# EAGLE design 3w developer v3 (EAGLE 5.07)
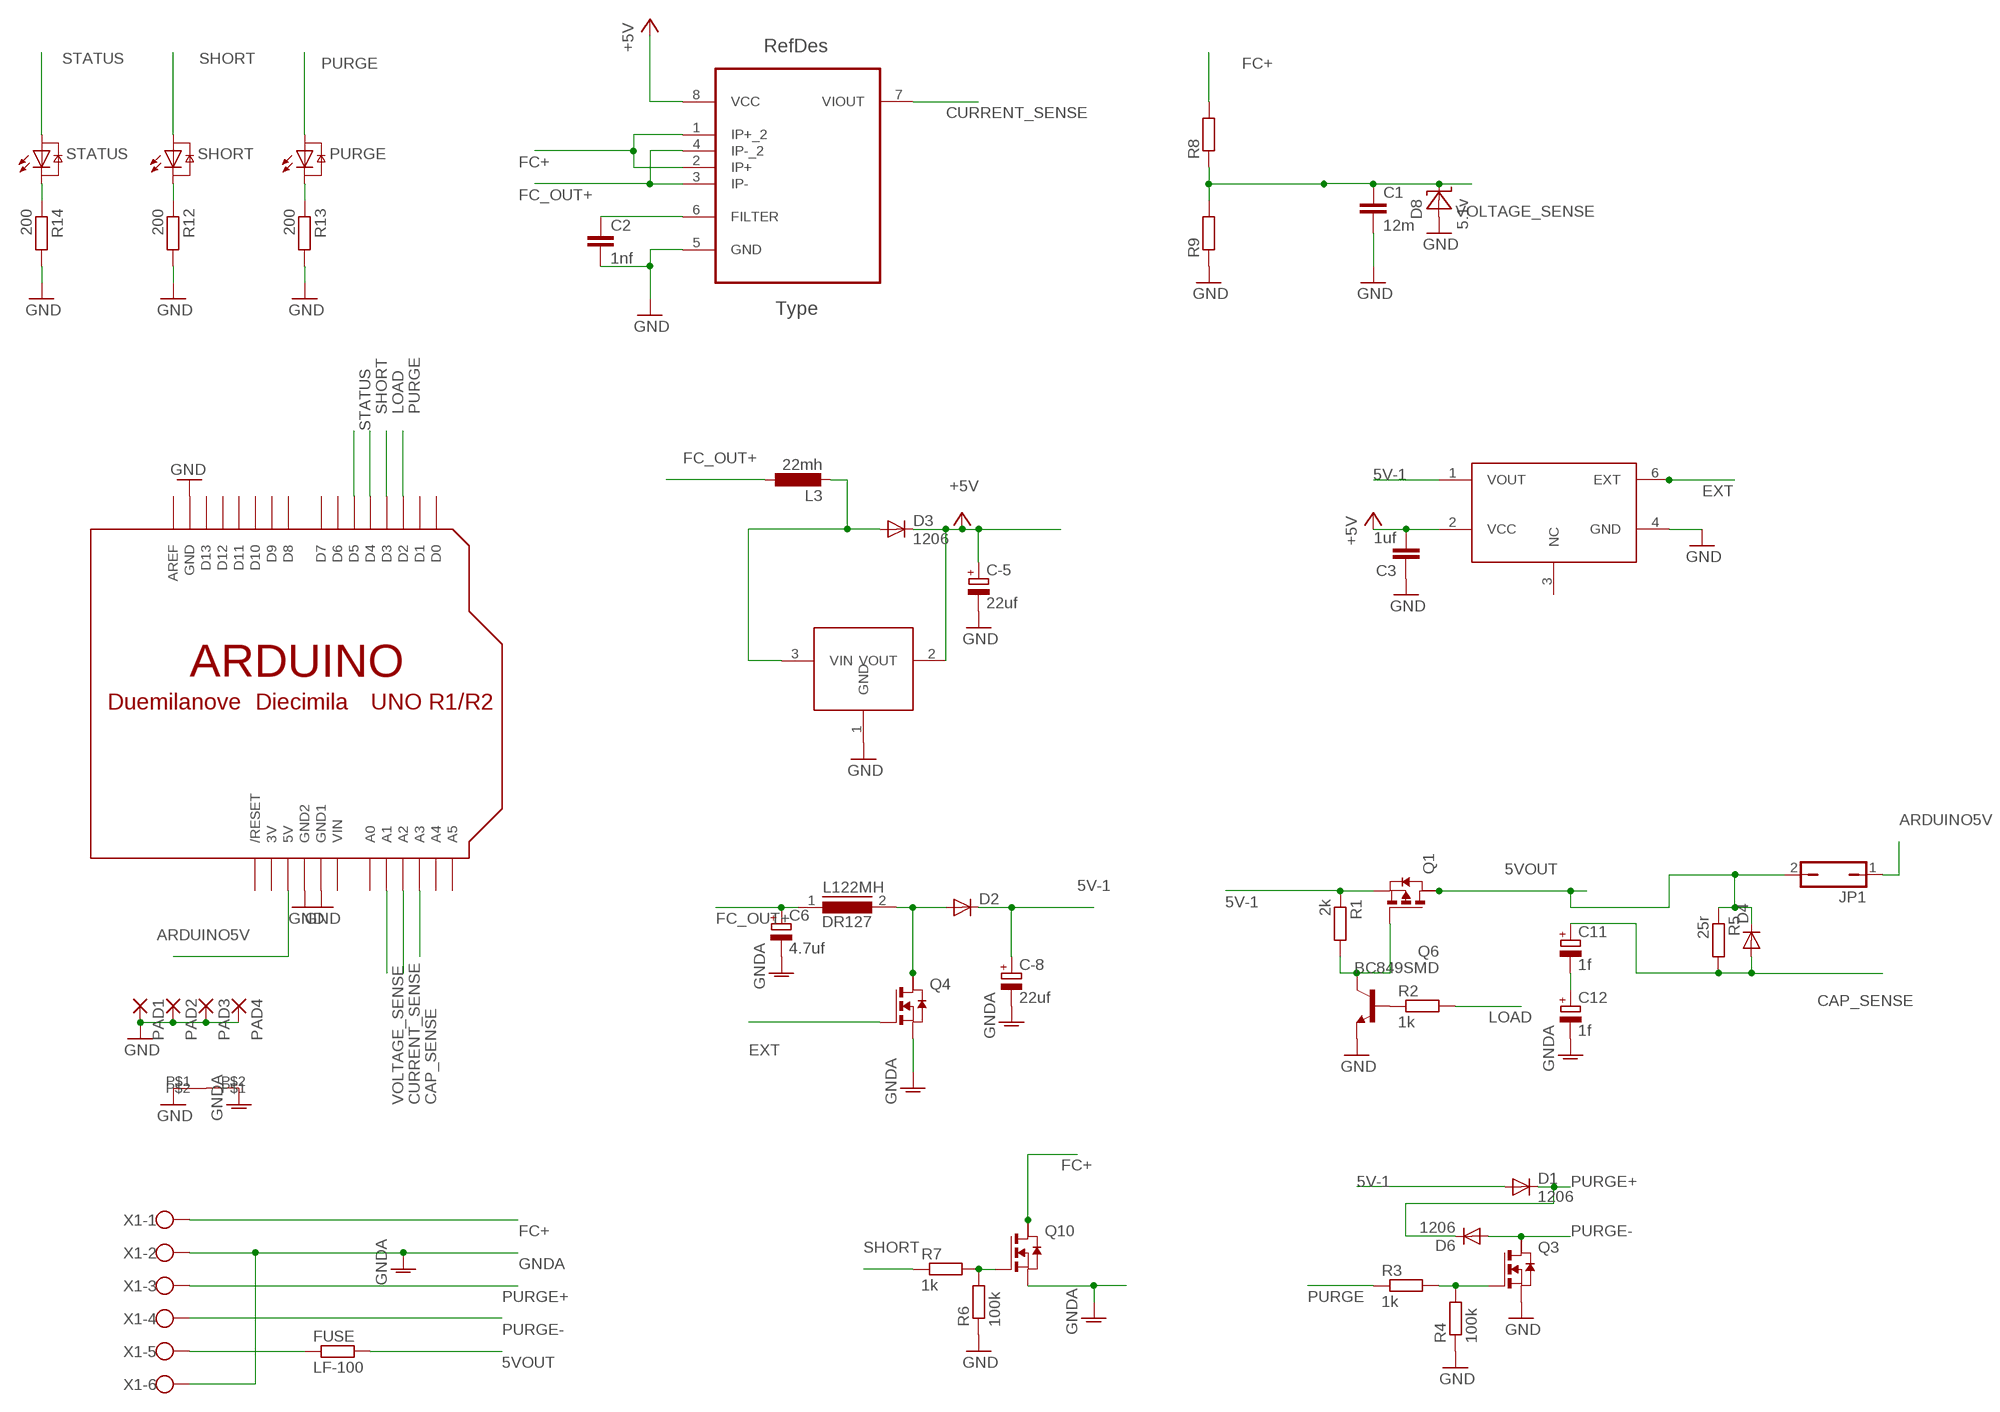
[diagram p0: schematic, sheet 1]

## Parts
C1  12m  C-EUC1206  [C1206]
C2  1nf  C-EUC1206  [C1206]
C3  1uf  C-EUC1206  [C1206]
C6  4.7uf  CPOL-EUSMCC  [SMC_C]
C11  1f  CPOL-EUE5-10.5  [E5-10,5]
C12  1f  CPOL-EUE5-10.5  [E5-10,5]
C-5  22uf  CPOL-EUSMCD  [SMC_D]
C-8  22uf  CPOL-EUSMCD  [SMC_D]
D1  1206  DIODE-GF1  [GF1]
D2  DIODE-DO214AA  [DO214AA]
D3  1206  DIODE-DO214AA  [DO214AA]
D4  DIODE-DO214AA  [DO214AA]
D6  1206  DIODE-GF1  [GF1]
D8  5.1v  1206ZENER  [C1206]
FUSE  LF-100  [LF100]
JP1  JP1Q  [JP1]
L3  22mh  L-EU  [MURATA-45223]
L122MH  DR127  [DR127]
PAD1  1,6/0,8  [1,6/0,8]
PAD2  1,6/0,8  [1,6/0,8]
PAD3  1,6/0,8  [1,6/0,8]
PAD4  1,6/0,8  [1,6/0,8]
PURGE  GM5BW96385A  [GM5BW96385A]
Q1  PMOSSOT223  [SOT223]
Q3  NMOSSOT223  [SOT223]
Q4  NMOSSOT223  [SOT223]
Q6  BC849SMD  [SOT23-BEC]
Q10  NMOSSOT223  [SOT223]
R1  2k  R-EU_M1206  [M1206]
R2  1k  R-EU_M1206  [M1206]
R3  1k  R-EU_M1206  [M1206]
R4  100k  R-EU_M1206  [M1206]
R5  25r  R-EU_R2512  [R2512]
R6  100k  R-EU_M1206  [M1206]
R7  1k  R-EU_M1206  [M1206]
R8  R-EU_R1206  [R1206]
R9  R-EU_R1206  [R1206]
R12  200  R-EU_M1206  [M1206]
R13  200  R-EU_M1206  [M1206]
R14  200  R-EU_M1206  [M1206]
SHORT  GM5BW96385A  [GM5BW96385A]
STATUS  GM5BW96385A  [GM5BW96385A]
U$3  ARDUINO-NOHOLE  [ARDUINO-NOHOLE]
U$4  SHORT  [SHORT]
UC1  MINIPAK-7750  [SOT89]
UC2  MINIPAK-E50  [SOT23-6]
UC3  ACS712ELCTR-05B-T  [SOIC127P600X175-8N]
X1  W237-6  [W237-6]

## Nets
5V-1: C-8.+ D1.A D2.C Q1.3(S) R1.1 UC2.1(VOUT)
5VOUT [power]: D4.C FUSE.P$2 JP1.2 Q1.2(D) R5.1
+5V [medpower]: C3.2 C-5.+ D3.C UC1.2(VOUT) UC2.2(VCC) UC3.8(VCC)
ARDUINO5V [medpower]: JP1.1 U$3.5V
CAP_SENSE: C11.+ D4.A R5.2 U$3.A3
CURRENT_SENSE: U$3.A2 UC3.7(VIOUT)
EXT: Q4.1(G) UC2.6(EXT)
FC+ [power]: Q10.2(D) R8.2 UC3.1(IP+_2) UC3.2(IP+) X1.1
FC_OUT+ [power]: C6.+ L3.P$1 L122MH.1 UC3.3(IP-) UC3.4(IP-_2)
GND: C1.2 C2.2 C3.1 C-5.- D8.ANODE(A) PAD1.1(P) PAD2.1(P) PAD3.1(P) PAD4.1(P) Q3.3(S) Q6.E R4.1 R6.1 R9.1 R12.2 R13.2 R14.2 U$3.GND U$3.GND1 U$3.GND2 U$4.P$1 UC1.1(GND) UC2.4(GND) UC3.5(GND)
GNDA [power]: C6.- C12.- C-8.- Q4.3(S) Q10.3(S) U$4.P$2 X1.2 X1.6
LOAD: R2.2 U$3.D3
N$1: Q10.1(G) R6.2 R7.2
N$2: Q1.1(G) Q6.C R1.2
N$3: D2.A L122MH.2 Q4.2(D)
N$5: Q6.B R2.1
N$6: D3.A L3.P$2 UC1.3(VIN)
N$7: Q3.1(G) R3.2 R4.2
N$8 [power]: C11.- C12.+
N$9: C2.1 UC3.6(FILTER)
N$10 [power]: FUSE.P$5 X1.5
N$14: R12.1 SHORT.C
N$15: PURGE.C R13.1
N$16: R14.1 STATUS.C
PURGE: PURGE.A R3.1 U$3.D2
PURGE+ [medpower]: D1.C D6.C X1.3
PURGE- [medpower]: D6.A Q3.2(D) X1.4
SHORT: R7.1 SHORT.A U$3.D4
STATUS: STATUS.A U$3.D5
VOLTAGE_SENSE: C1.1 D8.CATHODE(C) R8.1 R9.2 U$3.A1
Unconnected: Q1.4(D2) Q3.4(D2) Q4.4(D2) Q10.4(D2) U$3.A0 U$3.A4 U$3.A5 U$3.AREF U$3.D0 U$3.D1 U$3.D6 U$3.D7 U$3.D8 U$3.D9 U$3.D10 U$3.D11 U$3.D12 U$3.D13 U$3.RESET(/RESET) UC2.3(NC)

## Power pins joined to a net without a drawn wire
3V: U$3.3V
VIN: U$3.VIN

## Library data of the parts
C1-C3 = matt rcl:C-EU: CAPACITOR, European symbol
C6 = rcl:CPOL-EU: POLARIZED CAPACITOR, European symbol
C11 C12 C-5 C-8 = matt rcl:CPOL-EU: POLARIZED CAPACITOR, European symbol
D1-D4 D6 = matt diode:DIODE-: DIODE
D8 = matt diode:1206ZENER
FUSE = matt rcl:LF-100: polyfuse lf100 littelfuse
JP1 = jumper:JP1Q: JUMPER
L3 = matt rcl:L-EU: INDUCTOR, European symbol
L122MH = inductors:DR127: High Power Density, High Efficiency, Shielded Inductors Source: coiltronics_dr_series.pdf
PAD1-PAD4 = wirepad:1,6/0,8: THROUGH-HOLE PAD
PURGE SHORT STATUS = matt led:GM5BW96385A: High brightness White Color LED 2300 mcd @ IF = 20mA achieved via InGaN Blue LED chip in combination with Yellow Phosphor Source: http://document.sharpsma.com/files/GM5BW96385A.pdf
Q1 = zetex:PMOSSOT223: MOS FET
Q3 Q4 Q10 = zetex:NMOSSOT223: MOS FET
Q6 = matt transistor-npn:BC849*: NPN Transistor
R1-R4 R6 R7 R12-R14 = resistor:R-EU_: RESISTOR, European symbol
R5 R8 R9 = matt rcl:R-EU_: RESISTOR, European symbol
U$3 = adafruit:ARDUINO: Arduino Diecimila/Duemilanove Make a shield with ease, this package has all the named pins as well as the two mounting drill holes and an outline of the USB and DC power connector. The outline is on the DIMENSION layer, so if your board house uses it they will cut the outline to match. http://www.ladyada.net/library/pcb/eaglelibrary.html
U$4 = matt:SHORT
UC1 = matt:MINIPAK-7750
UC2 = matt:MINIPAK-E50
UC3 = matt-allegro:ACS712ELCTR-05B-T: Linear Current Sensor; DESCRIPTION: Linear Current Sensor; MPN: ACS712ELCTR-05B-T; OC_FARNELL: 27M3644; OC_NEWARK: 1329623; PACKAGE: SOIC-8; SUPPLIER: Allegro
X1 = con-wago-500:W237-6: WAGO SCREW CLAMP

## Net classes
1 power: width 3 mm
2 medpower: width 1 mm

## Board
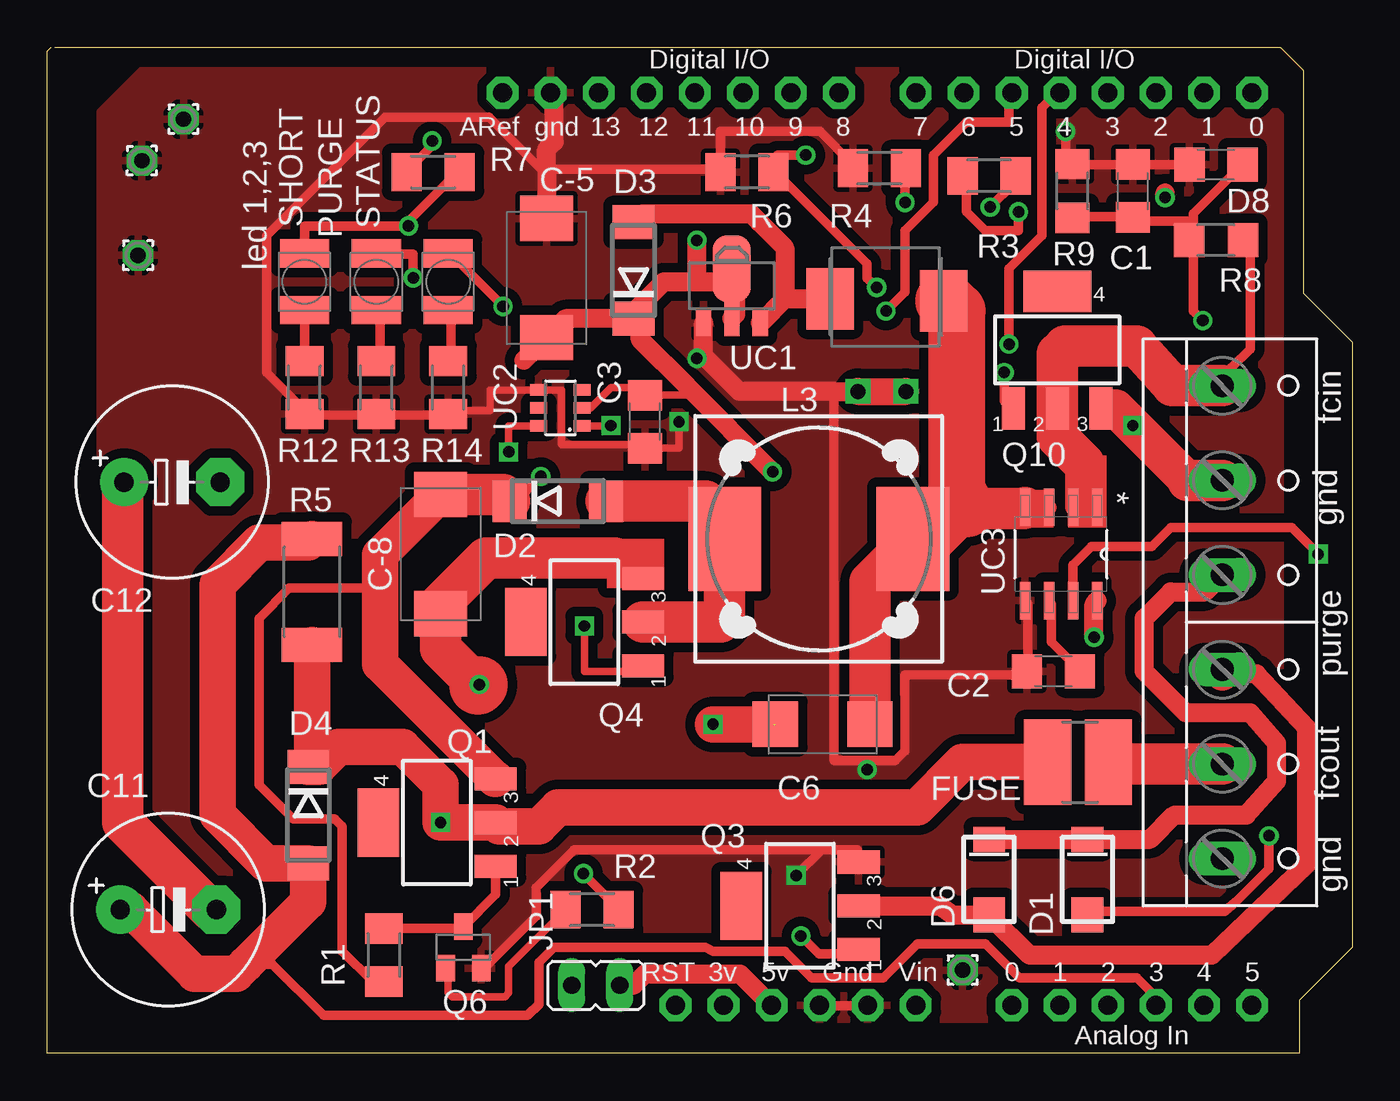
[diagram p1: board, top side]
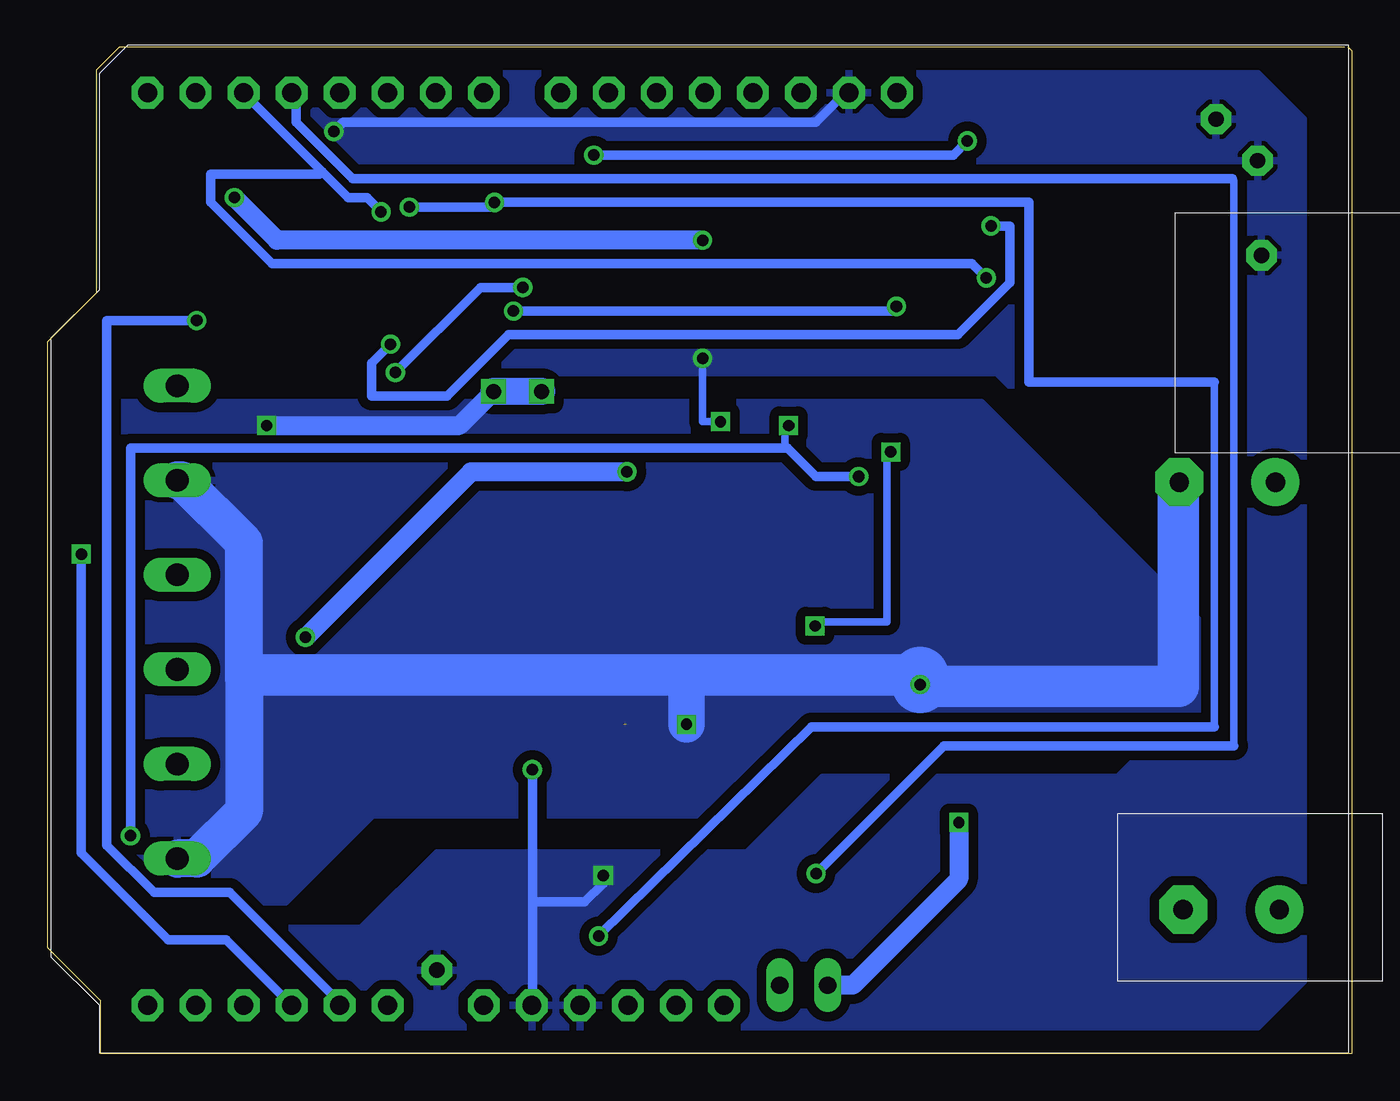
[diagram p2: board, bottom side, seen from below]

Size 69 x 53.2 mm. Coordinates in mm from the lower left corner, seen from the top.
Outline: 0.4,53.2 65.2,53.2 66.4,52 66.4,40.2 69,37.6 69,5.6 66.2,2.8 66.2,0 0,0 0,53 0.2,53.2
Copper layers (1*16): Top 0.035mm / dielectric 1.5mm / Bottom 0.035mm
Design rules "default *": minimum track width 20mil, minimum drill 24mil, track to track 10mil, track to pad 10mil, pad to pad 10mil, via to via 10mil, smd to smd 10mil, copper to edge 40mil, drill to drill 8mil, minimum pad ring 10mil, minimum via ring 8mil, stop-mask expansion 4mil, vias tented up to drill 0mil, thermal gap 10mil

### Footprints (pad centres in the part's own frame; a part is rotated, then mirrored left to right if it is on the bottom)
C1206 = smd 1.6 x 1.8: 1 -1.4,0; 2 1.4,0
SMC_C = smd 2.4 x 2.4: + -2.5,0; - 2.5,0
E5-10,5 = drill 1.016 pad 2.54 round: + -2.54,0 | drill 1.016 pad 2.54 octagon: - 2.54,0
SMC_D = smd 2.4 x 2.8: + -3.15,0; - 3.15,0
GF1 = smd 1.85 x 1.68: A 1.87,0 | smd 1.32 x 1.68: C -2.12,0
DO214AA = smd 1.8 x 2.2: A 2.55,0; C -2.55,0
C1206' = smd 1.6 x 1.8: ANODE -1.4,0; CATHODE 1.4,0
LF100 = smd 2.5 x 4.5: P$2 -1.7,0; P$5 1.5,0
JP1 = drill 0.914 long: 1 0,-1.27; 2 0,1.27
MURATA-45223 = smd 2.5 x 3.25: P$1 -3.6,0.2; P$2 2.4,0.1
DR127 = smd 3.85 x 5.5: 1 -4.975,0; 2 4.975,0
1,6/0,8 = drill 0.813 pad 1.6 octagon: 1 0,0
GM5BW96385A = smd 1.5 x 2.6: A -1.5,0; C 1.5,0
SOT223 = smd 1.219 x 2.235: 1 -2.311,-3.099; 2 0,-3.099; 3 2.311,-3.099 | smd 3.6 x 2.2: 4 0,3.099
SOT23-BEC = smd 1 x 1.4: B -0.95,-1.1; C 0,1.1; E 0.95,-1.1
M1206 = smd 1.6 x 2: 1 -1.4,0; 2 1.4,0
R2512 = smd 1.8 x 3.2: 1 -2.8,0; 2 2.8,0
R1206 = smd 1.6 x 1.803: 1 -1.422,0; 2 1.422,0
ARDUINO-NOHOLE = drill 1 pad 1.676 octagon: 3V 35.56,2.54; 5V 38.1,2.54; A0 50.8,2.54; A1 53.34,2.54; A2 55.88,2.54; A3 58.42,2.54; A4 60.96,2.54; A5 63.5,2.54; AREF 23.876,50.8; D0 63.5,50.8; D1 60.96,50.8; D2 58.42,50.8; D3 55.88,50.8; D4 53.34,50.8; D5 50.8,50.8; D6 48.26,50.8; D7 45.72,50.8; D8 41.656,50.8; D9 39.116,50.8; D10 36.576,50.8; D11 34.036,50.8; D12 31.496,50.8; D13 28.956,50.8; GND 26.416,50.8; GND1 43.18,2.54; GND2 40.64,2.54; RESET 33.02,2.54; VIN 45.72,2.54
SHORT = drill 0.8 square: P$1 -2.54,0; P$2 0,0
SOT89 = smd 0.8 x 1.4: 1 -1.499,-1.981; 3 1.499,-1.981 | smd 0.8 x 1.9: 2 0,-1.727 | smd 2 x 3.5: 2.1 0,0.889
SOT23-6 = smd 0.6 x 0.9: 1 -2.22,0.12; 2 -1.27,0.12; 3 -0.32,0.12; 4 -0.32,2.42; 5 -1.27,2.42; 6 -2.22,2.42
SOIC127P600X175-8N = smd 1.981 x 0.559: 1 -2.464,1.905; 2 -2.464,0.635; 3 -2.464,-0.635; 4 -2.464,-1.905; 5 2.464,-1.905; 6 2.464,-0.635; 7 2.464,0.635; 8 2.464,1.905
W237-6 = drill 1.194 long: 1 -12.5,-1.27; 2 -7.5,-1.27; 3 -2.5,-1.27; 4 2.5,-1.27; 5 7.5,-1.27; 6 12.5,-1.27

### Placement (x,y rotation side)
C1  57.4,45.6 90 top
C2  53.2,20.2 180 top
C3  31.6,33.4 90 top
C6  41,17.4 180 top
C11  6.4,7.6 0 top
C12  6.6,30.2 0 top
C-5  26.4,41 90 top
C-8  20.8,26.4 270 top
D1  55,9.2 270 top
D2  27,29.2 0 top
D3  31,41.4 90 top
D4  13.8,12.6 270 top
D6  49.8,9.2 270 top
D8  5.1v  [C1206']  61.8,47 0 top
FUSE  54.6,15.4 0 top
JP1  29,3.6 90 top
L3  43.8,40 180 top
L122MH  40.8,27.2 180 top
PAD1  7.2,49.4 0 top
PAD2  5,47.2 0 top
PAD3  4.8,42.2 0 top
PAD4  48.4,4.4 0 top
PURGE  17.4,40.8 270 top
Q1  20.6,12.2 90 top
Q3  39.8,7.8 90 top
Q4  28.4,22.8 90 top
Q6  22,5.6 0 top
Q10  53.4,37.2 0 top
R1  17.8,5.2 90 top
R2  28.8,7.6 0 top
R3  49.8,46.4 0 top
R4  44,46.8 0 top
R5  14,24.4 90 top
R6  37,46.6 0 top
R7  20.4,46.6 180 top
R8  61.8,43 0 top
R9  54.2,45.6 270 top
R12  13.6,35.2 270 top
R13  17.4,35.2 270 top
R14  21.2,35.2 270 top
SHORT  13.6,40.8 270 top
STATUS  21.2,40.8 270 top
U$1  [FABLABLOGO]  59.6,6 90 top
U$3  0.2,0 0 top
U$4  45.4,35 0 top
UC1  36.2,40.6 0 top
UC2  28.4,35.4 90 top
UC3  53.6,26.4 270 top
X1  63.4,22.8 270 top

### Tracks (layer width: path | path; a pad name or v marks a point on that pad's centre or on a via)
5V-1  (via drill 0.6, 0.61)
  Top 0.406: UC2.1 29.8,33.18 v29.8,33.2
  Top 0.5: R1.1 17.2,3.8 15.6,5.4 15.6,12 15.2,12.4 13,12.4 11.2,14.2 11.2,23 12.8,24.6 17.4,24.6 17.6,24.4
  Top 0.508: v26.1,30.5 25.35,29.75 D2.C | v64.6,11.5 64.6,9.75 62.85,8 62.25,7.5 55.1,7.5 D1.A
  Top 1.93: Q1.3 23.69,14.51 17.6,20.6 17.6,24.4 17.6,26.35 C-8.+
  Top 2.184: C-8.+ 24.1,29.55 D2.C
  Bottom 0.406: v29.8,33.2 30,33.2 30,32
  Bottom 0.5: 28.1,30.5 28.35,30.5 29.85,32
  Bottom 0.508: v26.1,30.5 28.1,30.5 | v64.6,11.5 64.6,32 30,32 29.85,32
5VOUT  (via drill 0.6)
  Top 1.93: R5.1 14,15.35 D4.C 14.35,15.15 15.4,16.2 18.8,16.2 20.8,14.2 v20.8,12.2 Q1.2 23.9,12 26,12 27,13 46,13 48.4,15.4 FUSE.P$2
  Bottom 1.016: JP1.2 26.4,3.6 20.8,9.2 v20.8,12.2
+5V  (via drill 0.61)
  Top 0.4: UC2.2 28.73,34.13 29.8,35.2 31.2,35.2 C3.2
  Top 0.406: C3.2 33.85,34.8 33.85,35.25
  Top 1: v59.1,45.25 59.1,45.5 | 34.35,40.8 v34.35,43 | v55.35,22 55.35,23.75 UC3.8 | v38.35,30.75 33.85,35.25 31.35,37.75 31.35,38.5 D3.C
  Top 1.016: 25.2,36.65 C-5.+ 27.4,38.85 D3.C 31,39.2 32.6,40.8 34.35,40.8 35.4,40.8 36.4,39.8 36.4,39.07 UC1.2
  Bottom 1: v59.1,45.25 56.85,43 v34.35,43 | v55.35,22 46.6,30.75 v38.35,30.75
ARDUINO5V
  Top 1.016: JP1.1 31,3.6 31.6,4.2 36.64,4.2 U$3.5V
CAP_SENSE
  Top 0.5: 58.62,2.42 U$3.A3 58.62,2.98 57.6,4 51.4,4 49.6,5.8 46,5.8 44.2,4 40.4,4 39,5.4 35.2,5.4 34.8,5.6 26.8,5.6 26,4.8 26,2.6 25.4,2 14.6,2 11.9,4.7 10.5,4.7
  Top 1.93: C11.+ 4.4,7.6 7.8,4.2 10,4.2 10.5,4.7 13.8,8 D4.A 11.55,10.05 9,12.6 9,24.8 11.2,27 13.8,27 R5.2
CURRENT_SENSE  (via drill 0.6)
  Top 0.5: UC3.7 54.23,25.84 55.2,26.8 58.4,26.8 59.4,27.8 65.8,27.8 v67.2,26.4
  Bottom 0.5: v67.2,26.4 67.2,10.6 62.6,6 59.54,6 U$3.A2
EXT  (via drill 0.6)
  Top 0.406: UC2.6 24.4,33.18 v24.4,31.8 | v28.4,22.6 28.4,20.2 31.5,20.2 Q4.1
  Bottom 0.406: v24.4,31.8 24.6,31.8 24.6,22.8 28.4,22.8 v28.4,22.6
FC+
  Top 0.5: R8.2 63.35,43 63.6,42.75 63.6,37.25 62.6,36.25 X1.1
  Top 0.813: UC3.1 UC3.2 54.23,30.64 54.8,31.2
  Top 1.778: 53.4,37 53.8,37.4 | Q10.2 53.4,34.3
  Top 2.184: X1.1 59.5,35.3 57.6,37.4 53.8,37.4 | 53.4,34.3 53.4,37 | Q10.2 53.4,32.6 54.8,31.2
FC_OUT+
  Top 0.813: UC3.4 UC3.3
  Top 2.184: C6.+ 43.5,24.93 L122MH.1 47,27.2 48.6,28.8 51.63,28.8 UC3.4
  Top 3: L3.P$1 47.6,39.75 48.1,39.25 48.1,29.75 48.6,28.8
GND  (via drill 0.6, 0.61)
  Top 0.406: v33.4,33.4 33.4,32 C3.1 31.2,32.2 27.2,32.2 27.2,35.08 UC2.4 23.4,35.08 23.4,34 21.2,34 R14.2
  Top 0.5: C1.2 D8.ANODE | 40.6,10.75 42.6,10.75 43.15,10.2 | 43.15,10.2 42.8,10.2 43,10 43.35,10 43.15,10.2 | 42.85,10.75 40.95,10.75 v39.6,9.4
  Top 0.508: UC3.5 51.85,23.75 51.85,20.25 C2.2 51.6,20 45.35,20 45.35,16 44.85,15.5 43.35,15.5 | 43.35,15.5 41.6,15.5 41.6,35 | U$3.GND1 43.35,2.5 40.85,2.5 U$3.GND2 40.6,2.75 | Q6.E 23.1,4.5 25.85,7.25 25.85,8.75 27.85,10.75 40.6,10.75 42.85,10.75 42.85,10.25 Q3.3 | v43.35,15 43.35,15.5 | R14.2 21.1,33.75 17.6,33.75 R13.2 17.35,33.75 13.6,33.75 R12.2 13.6,34 11.6,36 11.6,43.25 17.85,49.5 23.35,49.5 26.1,46.75 26.4,46.75 35.6,46.75 R6.1 35.6,48.75 40.85,48.75 42.6,47 R4.1 | C1.2 54.35,47 R9.1 54.1,47.25 53.85,47.5 v53.85,48.75 | 34.7,36.9 v34.35,36.75
  Top 1.016: UC1.1 34.7,36.9 36.6,35 41.6,35 U$4.P$1 | C-5.- 26.4,46.75 26.4,47.8 26.8,48.2 26.8,50.62 U$3.GND
  Bottom 0.406: v33.4,33.4 34.35,33.4 v34.35,36.75
  Bottom 0.5: v39.6,9.4 39.6,9 40.6,8 43.15,8 43.35,8.2
  Bottom 0.508: v43.35,15 43.35,8.2 43.35,2.75 U$3.GND1 | v53.85,48.75 53.35,49.25 28.35,49.25 26.85,50.75 U$3.GND
  pour Bottom (isolate 0.5): 65,36.2 65,51.2 64.4,51.8 5,51.8 2.6,49.4 2.6,3.8 5,1.4 63,1.4 66.2,4.6 66.2,5.8 65.4,6.6 52.4,6.6 48.4,10.6 32,10.6 28,14.6 12.4,14.6 8.4,18.6 8.4,25.8 18.8,36 64.6,36 64.8,36.2
  pour Top (isolate 0.5): 2.8,3.8 2.8,49.8 5,52 62.8,52 65.2,49.6 65.2,3.8 63.2,1.8 5,1.8 3,3.8
GNDA  (via drill 0.6, 0.61)  (1 unrouted)
  Top 0.406: 56.5,34.1 Q10.3
  Top 0.813: 30,26.2 30.41,26.2 Q4.3
  Top 1.93: v35.2,17.4 38.4,17.4
  Top 2: 60.3,30.3 v57.4,33.2 56.5,34.1
  Top 2.184: 30,26.2 23.2,26.2 20.8,23.8 C-8.- 20.8,21.4 22.78,19.43 | X1.2 60.3,30.3
  Top 3: v22.85,19.5 22.78,19.43
  Bottom 1: U$4.P$2 47.2,33.2 v57.4,33.2
  Bottom 1.93: 35.2,20 v35.2,17.4
  Bottom 2: X1.6 61.1,10.3 58.6,12.8 58.6,19.8 | X1.2 61.9,30.3 58.6,27 58.6,19.8 | 58.4,20 58.6,19.8
  Bottom 2.184: 23,20 22.85,20 | 23,20 35.2,20 58.4,20 | C12.- 9.2,30.2 9.2,19.4 23,19.4 23,20
  Bottom 3: 22.85,20 v22.85,19.5
  pour Bottom (isolate 0.5, rank 2): 67.8,34.4 19.6,34.4 7.6,22.4 7.6,17.8 12.8,12.6 51.8,12.6 56.4,8 64,8 65.4,9.4 65.4,13.6 67.8,16
LOAD  (via drill 0.61)
  Top 0.508: v28.35,9.5 30.1,7.75 R2.2
  Bottom 0.406: 6.25,16.25 6.25,46.15 6.35,46.25
  Bottom 0.508: v28.35,9.5 21.6,16.25 6.25,16.25 | 6.35,46.25 52.85,46.25 55.85,49.25 55.85,50.75 U$3.D3
N$1  (via drill 0.61)
  Top 0.508: v20.35,48.25 20.35,48 19.1,46.75 R7.2 | v40.1,47.5 38.6,47.5 38.6,46.75 R6.2 38.6,46.5 43.35,41.75 43.35,41 v43.85,40.5 | v50.6,36 50.6,34.5 50.85,34.25 Q10.1
  Bottom 0.508: v20.35,48.25 21.1,47.5 v40.1,47.5 | v50.6,36 46.1,40.5 v43.85,40.5
N$2
  Top 0.5: Q1.1 23.7,8.4 Q6.C 21.9,6.6 R1.2
N$3
  Top 1.778: 35.8,27.18 L122MH.2
  Top 2.184: Q4.2 35.6,22.8 35.8,23 35.8,27.18 | L122MH.2 35.8,27.23 35.8,28.6 35.6,28.4 34.8,29.2 D2.A
N$5
  Top 0.406: Q6.B 21.2,4.5 21.2,3.2 21.4,3 24.2,3 24.4,3.2 24.4,4.6 R2.1
N$6
  Top 1: 37.65,43.95 37.2,44.4 31.45,44.4 D3.A
  Top 1.016: 39.2,39.9 38.98,39.9 UC1.3 | 39.2,39.9 L3.P$2 | 37.65,43.95 39,42.6 39,40.1 39.2,39.9
N$7  (via drill 0.61)
  Top 0.5: 42.85,5.25 40.8,5.25 v39.85,6.2
  Top 0.508: v45.35,45 45.35,46.75 R4.2 | v49.85,44.75 51.1,46 51.1,46.25 R3.2 | 42.85,5.25 Q3.1
  Bottom 0.406: 7.3,17.25 7.3,35.5
  Bottom 0.508: v49.85,44.75 45.6,44.75 v45.35,45 17.1,45 17.1,35.5 7.3,35.5 | v39.85,6.2 28.6,17.25 7.3,17.25
N$8
  Top 2.184: C11.- 8.6,7.6 4,12.2 4,30.14 C12.+
N$9
  Top 0.508: C2.1 54.6,20.25 53.1,21.75 53.1,23.75 UC3.6
N$10
  Top 1.778: FUSE.P$5 56.3,15.3
  Top 2.184: 56.3,15.3 X1.5
N$14
  Top 0.508: R12.1 SHORT.C
N$15
  Top 0.508: R13.1 17.6,36.75 17.6,39.25 PURGE.C
N$16
  Top 0.508: R14.1 21.35,36.75 21.35,39.25 STATUS.C
PURGE  (via drill 0.61)
  Top 0.508: v51.35,44.5 51.35,43.5 49.6,43.5 48.6,44.5 48.6,46.25 R3.1 | v19.35,41 19.35,42.25 17.6,42.25 PURGE.A
  Bottom 0.508: v51.35,44.5 52.1,45.25 53.1,45.25 54.47,46.62 | 54.47,46.62 58.6,50.75 U$3.D2 | v19.35,41 20.1,41.75 57.1,41.75 60.35,45 60.35,46.5 54.6,46.5 54.47,46.62
PURGE+
  Top 1: 63.6,18 60.2,18
  Top 1.016: D6.C D1.C 58.32,11.32 59.6,12.6 63.4,12.6 65,14.4 65,16.4 63.6,18 | 60.2,18 58,20.2 58,23 59.4,24.4 61.23,24.4 X1.3
PURGE-
  Top 1.016: Q3.2 47.2,7.8 47.87,7.33 D6.A 51.93,5.2 61.6,5.2 66.6,10 66.6,17.2 63.93,20.07 62.13,20.07
  Top 1.778: 62.13,20.07 X1.4
SHORT  (via drill 0.61)
  Top 0.508: 18.98,43.88 18.85,43.75 13.6,43.75 SHORT.A | 18.98,43.88 21.6,46.5 R7.1 | v50.85,37.5 50.85,41.5 52.6,43.25 52.6,50 53.35,50.75 U$3.D4 | 18.98,43.88 v19.1,43.75
  Bottom 0.508: v50.85,37.5 51.85,36.5 51.85,34.75 47.85,34.75 44.6,38 20.85,38 18.1,40.75 18.1,43.75 v19.1,43.75
STATUS  (via drill 0.61)
  Top 0.508: v24.1,39.5 21.35,42.25 STATUS.A | v44.35,39.25 45.35,40.25 45.35,43.5 46.85,45 46.85,47.5 48.6,49.25 50.85,49.25 50.85,50.75 U$3.D5
  Bottom 0.508: v24.1,39.5 24.35,39.25 v44.35,39.25
VOLTAGE_SENSE  (via drill 0.61)
  Top 0.5: 60.6,44.25 60.6,44.4 D8.CATHODE
  Top 0.508: R9.2 54.35,44.25 57.35,44.25 C1.1 57.6,44 60.6,44 | 60.6,44 60.6,43 R8.1 60.6,42.75 60.6,39.25 v61.1,38.75 | 60.6,44 60.6,44.25
  Bottom 0.508: v61.1,38.75 65.85,38.75 65.85,11 63.35,8.5 59.35,8.5 53.6,2.75 U$3.A1
(copper drawn outside any net)
  shapes: Top area x3

### Text on the board
tPlace: purge
tNames: led 1,2,3 | fcin | gnd | fcout | gnd